# EAGLE board nt08 (EAGLE 6.6.0), part 1 of 6
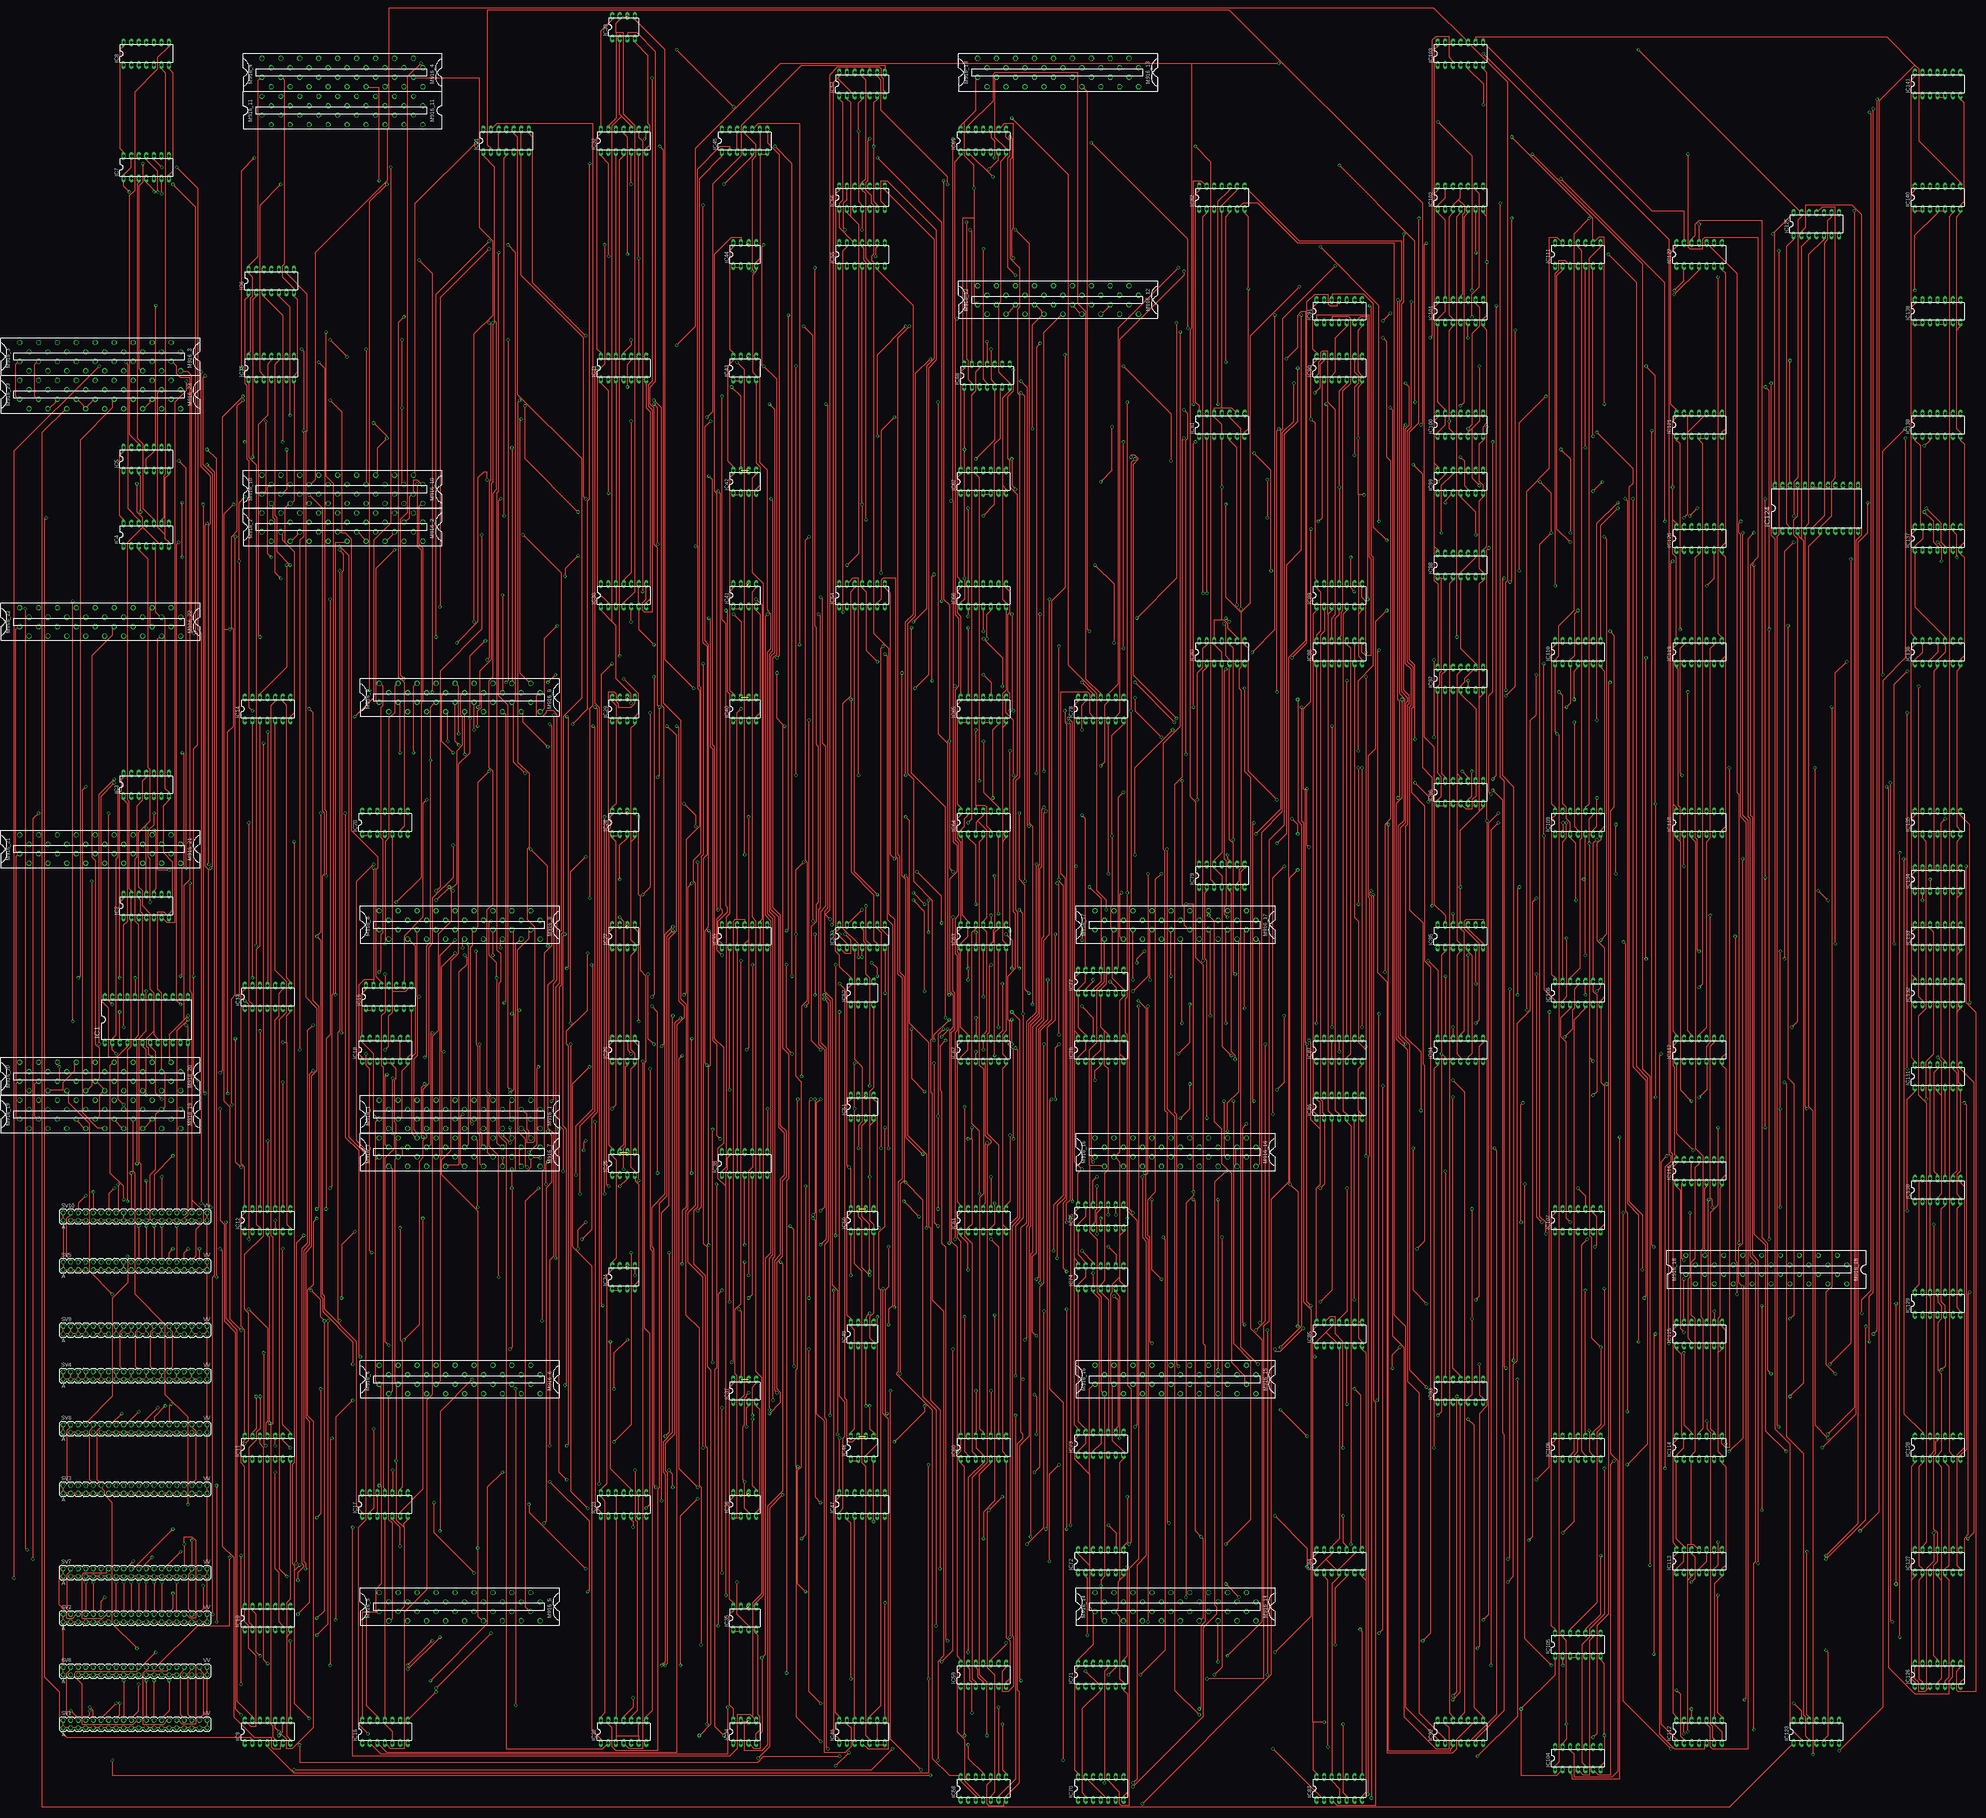
[diagram p7: board, top side]
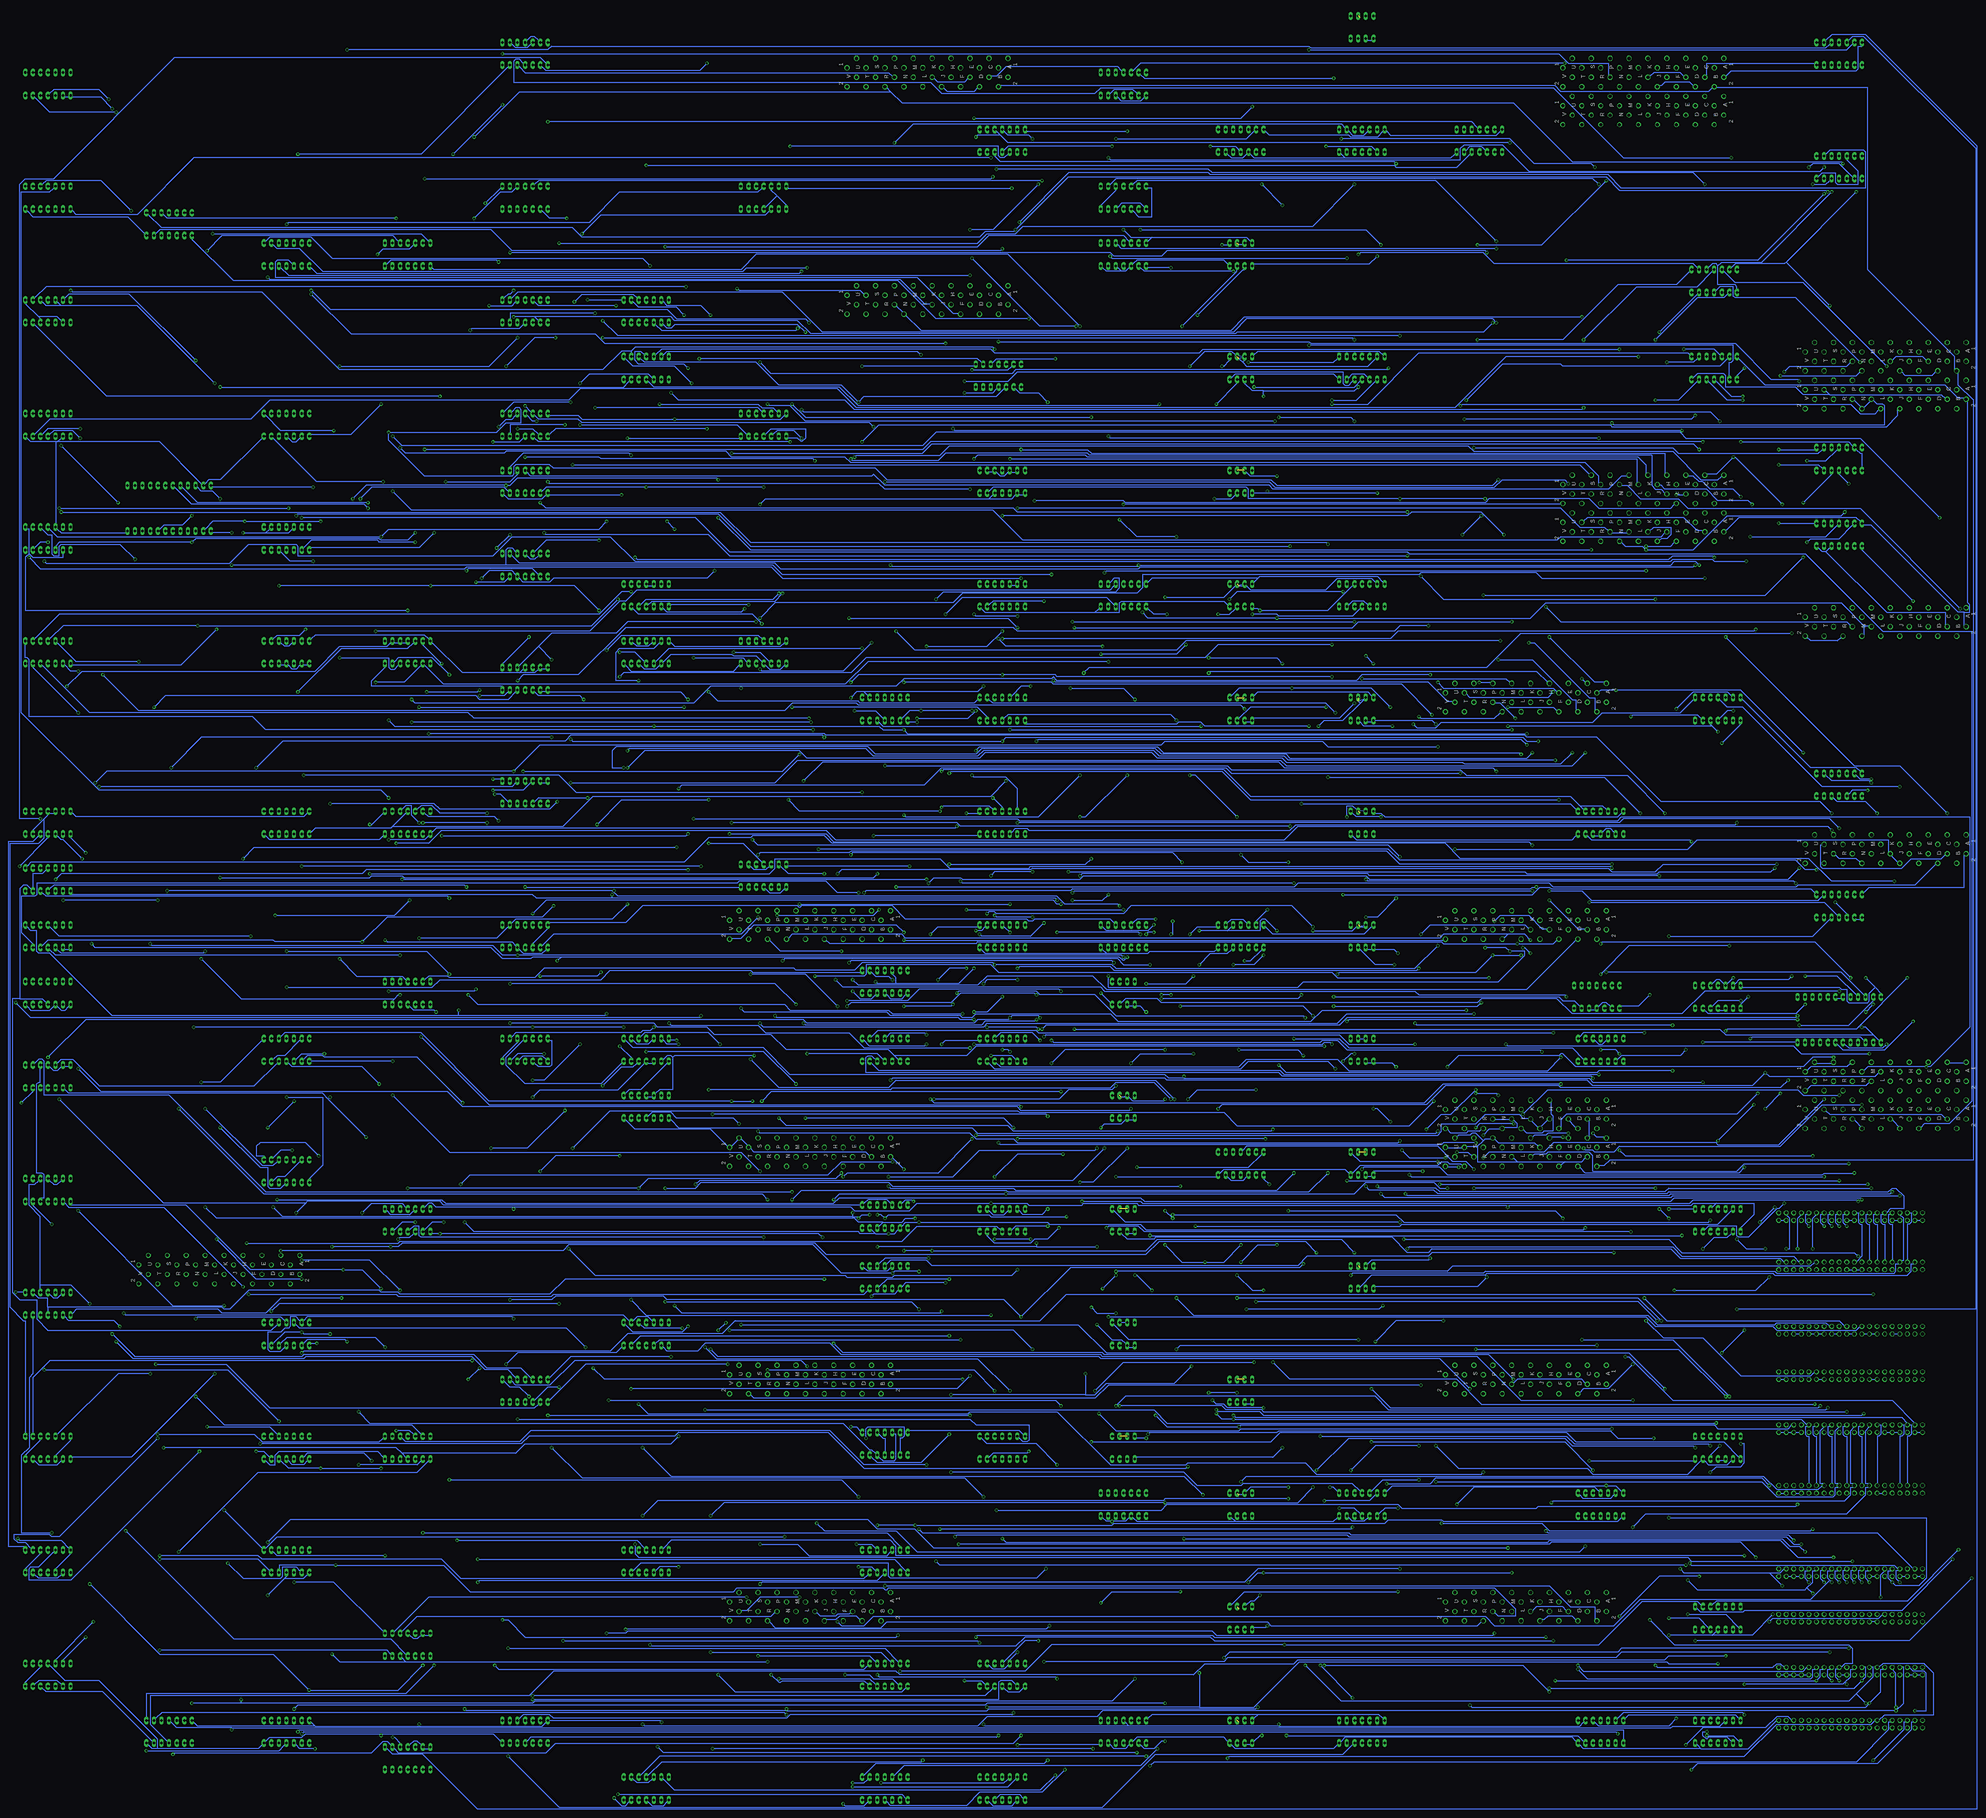
[diagram p8: board, bottom side, seen from below]

No outline drawn. Coordinates in mm, seen from the top.
Copper layers (1*16): Top 0.035mm / dielectric 1.5mm / Bottom 0.035mm
Design rules "10mils": minimum track width 10mil, minimum drill 24mil, track to track 10mil, track to pad 10mil, pad to pad 10mil, via to via 10mil, smd to smd 10mil, copper to edge 40mil, drill to drill 10mil, minimum pad ring 10mil, minimum via ring 8mil, stop-mask expansion 0mil, vias tented up to drill 0mil, thermal gap 10mil

## Footprints (pad centres in the part's own frame; a part is rotated, then mirrored left to right if it is on the bottom)
DIL24-6 = drill 0.813 long: 1 -13.97,-7.62; 2 -11.43,-7.62; 3 -8.89,-7.62; 4 -6.35,-7.62; 5 -3.81,-7.62; 6 -1.27,-7.62; 7 1.27,-7.62; 8 3.81,-7.62; 9 6.35,-7.62; 10 8.89,-7.62; 11 11.43,-7.62; 12 13.97,-7.62; 13 13.97,7.62; 14 11.43,7.62; 15 8.89,7.62; 16 6.35,7.62; 17 3.81,7.62; 18 1.27,7.62; 19 -1.27,7.62; 20 -3.81,7.62; 21 -6.35,7.62; 22 -8.89,7.62; 23 -11.43,7.62; 24 -13.97,7.62
DIL14 = drill 0.813 long: 1 -7.62,-3.81; 2 -5.08,-3.81; 3 -2.54,-3.81; 4 0,-3.81; 5 2.54,-3.81; 6 5.08,-3.81; 7 7.62,-3.81; 8 7.62,3.81; 9 5.08,3.81; 10 2.54,3.81; 11 0,3.81; 12 -2.54,3.81; 13 -5.08,3.81; 14 -7.62,3.81
DIL08 = drill 0.813 long: 1 -3.81,-3.81; 2 -1.27,-3.81; 3 1.27,-3.81; 4 3.81,-3.81; 5 3.81,3.81; 6 1.27,3.81; 7 -1.27,3.81; 8 -3.81,3.81
H807 = drill 1.092 octagon: A1 4.763,28.575; A2 -1.587,28.575; B1 1.587,25.4; B2 -4.763,25.4; C1 4.763,22.225; C2 -1.587,22.225; D1 1.587,19.05; D2 -4.763,19.05; E1 4.763,15.875; E2 -1.587,15.875; F1 1.587,12.7; F2 -4.763,12.7; H1 4.763,9.525; H2 -1.587,9.525; J1 1.587,6.35; J2 -4.763,6.35; K1 4.763,3.175; K2 -1.587,3.175; L1 1.587,0; L2 -4.763,0; M1 4.763,-3.175; M2 -1.587,-3.175; N1 1.587,-6.35; N2 -4.763,-6.35; P1 4.763,-9.525; P2 -1.587,-9.525; R1 1.587,-12.7; R2 -4.763,-12.7; S1 4.763,-15.875; S2 -1.587,-15.875; T1 1.587,-19.05; T2 -4.763,-19.05; U1 4.763,-22.225; U2 -1.587,-22.225; V1 1.587,-25.4; V2 -4.763,-25.4
H807@1 = drill 1.016 octagon: A1 4.763,28.575; A2 -1.587,28.575; B1 1.587,25.4; B2 -4.763,25.4; C1 4.763,22.225; C2 -1.587,22.225; D1 1.587,19.05; D2 -4.763,19.05; E1 4.763,15.875; E2 -1.587,15.875; F1 1.587,12.7; F2 -4.763,12.7; H1 4.763,9.525; H2 -1.587,9.525; J1 1.587,6.35; J2 -4.763,6.35; K1 4.763,3.175; K2 -1.587,3.175; L1 1.587,0; L2 -4.763,0; M1 4.763,-3.175; M2 -1.587,-3.175; N1 1.587,-6.35; N2 -4.763,-6.35; P1 4.763,-9.525; P2 -1.587,-9.525; R1 1.587,-12.7; R2 -4.763,-12.7; S1 4.763,-15.875; S2 -1.587,-15.875; T1 1.587,-19.05; T2 -4.763,-19.05; U1 4.763,-22.225; U2 -1.587,-22.225; V1 1.587,-25.4; V2 -4.763,-25.4
DEC40PINV = drill 1.016 octagon: A -24.13,-1.27; AA 3.81,-1.27; B -24.13,1.27; BB 3.81,1.27; C -21.59,-1.27; CC 6.35,-1.27; D -21.59,1.27; DD 6.35,1.27; E -19.05,-1.27; EE 8.89,-1.27; F -19.05,1.27; FF 8.89,1.27; H -16.51,-1.27; HH 11.43,-1.27; J -16.51,1.27; JJ 11.43,1.27; K -13.97,-1.27; KK 13.97,-1.27; L -13.97,1.27; LL 13.97,1.27; M -11.43,-1.27; MM 16.51,-1.27; N -11.43,1.27; NN 16.51,1.27; P -8.89,-1.27; PP 19.05,-1.27; R -8.89,1.27; RR 19.05,1.27; S -6.35,-1.27; SS 21.59,-1.27; T -6.35,1.27; TT 21.59,1.27; U -3.81,-1.27; UU 24.13,-1.27; V -3.81,1.27; VV 24.13,1.27; W -1.27,-1.27; X -1.27,1.27; Y 1.27,-1.27; Z 1.27,1.27

## Placement (x,y rotation side)
IC1  74154N  [DIL24-6]  0,257.81 0 top
IC2  74LS10N  [DIL14]  0,295.91 0 top
IC3  74LS04N  [DIL14]  0,336.55 0 top
IC4  74LS04N  [DIL14]  0,420.37 0 top
IC5  74LS74N  [DIL14]  0,445.77 0 top
IC6  74LS74N  [DIL14]  41.91,505.46 0 top
IC7  74LS74N  [DIL14]  0,543.56 0 top
IC8  74LS20N  [DIL14]  0,581.66 0 top
IC9  74LS20N  [DIL14]  40.64,19.05 0 top
IC10  74LS20N  [DIL14]  40.64,57.15 0 top
IC11  74LS00N  [DIL14]  40.64,114.3 0 top
IC12  74LS00N  [DIL14]  40.64,190.5 0 top
IC13  74LS00N  [DIL14]  40.64,265.43 0 top
IC14  74LS04N  [DIL14]  40.64,361.95 0 top
IC15  74LS04N  [DIL14]  41.91,476.25 0 top
IC16  74LS00N  [DIL14]  80.01,19.05 0 top
IC17  74LS00N  [DIL14]  80.01,95.25 0 top
IC18  74H40N  [DIL14]  80.01,247.65 0 top
IC19  74H40N  [DIL14]  81.28,265.43 0 top
IC20  74H40N  [DIL14]  80.01,323.85 0 top
IC21  74LS02N  [DIL14]  120.65,552.45 0 top
IC22  74LS02N  [DIL14]  160.02,19.05 0 top
IC23  74LS02N  [DIL14]  160.02,95.25 0 top
IC24  DS75452N  [DIL08]  160.02,171.45 0 top
IC25  DS75452N  [DIL08]  160.02,209.55 0 top
IC26  DS75452N  [DIL08]  160.02,247.65 0 top
IC27  DS75452N  [DIL08]  160.02,285.75 0 top
IC28  DS75452N  [DIL08]  160.02,323.85 0 top
IC29  DS75452N  [DIL08]  160.02,361.95 0 top
IC30  74LS02N  [DIL14]  160.02,400.05 0 top
IC31  74LS02N  [DIL14]  160.02,476.25 0 top
IC32  74LS02N  [DIL14]  160.02,552.45 0 top
IC33  DS75452N  [DIL08]  160.02,590.55 0 top
IC34  DS75452N  [DIL08]  200.66,19.05 0 top
IC35  DS75452N  [DIL08]  200.66,57.15 0 top
IC36  DS75452N  [DIL08]  200.66,95.25 0 top
IC37  DS75452N  [DIL08]  200.66,133.35 0 top
IC38  74LS02N  [DIL14]  200.66,209.55 0 top
IC39  74LS02N  [DIL14]  200.66,285.75 0 top
IC40  DS75452N  [DIL08]  200.66,361.95 0 top
IC41  DS75452N  [DIL08]  200.66,400.05 0 top
IC42  DS75452N  [DIL08]  200.66,438.15 0 top
IC43  DS75452N  [DIL08]  200.66,476.25 0 top
IC44  DS75452N  [DIL08]  200.66,514.35 0 top
IC45  74LS02N  [DIL14]  200.66,552.45 0 top
IC46  74LS02N  [DIL14]  240.03,19.05 0 top
IC47  74LS02N  [DIL14]  240.03,95.25 0 top
IC48  DS75452N  [DIL08]  240.03,114.3 0 top
IC49  DS75452N  [DIL08]  240.03,152.4 0 top
IC50  DS75452N  [DIL08]  240.03,190.5 0 top
IC51  DS75452N  [DIL08]  240.03,228.6 0 top
IC52  DS75452N  [DIL08]  240.03,266.7 0 top
IC53  74LS04N  [DIL14]  240.03,285.75 0 top
IC54  74LS04N  [DIL14]  240.03,400.05 0 top
IC55  74LS04N  [DIL14]  240.03,514.35 0 top
IC56  74LS73N  [DIL14]  240.03,533.4 0 top
IC57  74LS73N  [DIL14]  240.03,571.5 0 top
IC58  74LS73N  [DIL14]  280.67,0 0 top
IC59  74LS00N  [DIL14]  280.67,38.1 0 top
IC60  74LS00N  [DIL14]  280.67,114.3 0 top
IC61  74LS00N  [DIL14]  280.67,190.5 0 top
IC62  74LS74N  [DIL14]  280.67,247.65 0 top
IC63  74LS74N  [DIL14]  280.67,285.75 0 top
IC64  74LS74N  [DIL14]  280.67,323.85 0 top
IC65  74H40N  [DIL14]  280.67,361.95 0 top
IC66  74H40N  [DIL14]  280.67,400.05 0 top
IC67  74H40N  [DIL14]  280.67,438.15 0 top
IC68  74LS10N  [DIL14]  281.94,473.71 0 top
IC69  74LS10N  [DIL14]  280.67,552.45 0 top
IC70  74LS20N  [DIL14]  320.04,0 0 top
IC71  74LS20N  [DIL14]  320.04,38.1 0 top
IC72  74LS20N  [DIL14]  320.04,76.2 0 top
IC73  74LS74N  [DIL14]  320.04,115.57 0 top
IC74  74LS74N  [DIL14]  320.04,171.45 0 top
IC75  74LS74N  [DIL14]  320.04,191.77 0 top
IC76  74LS74N  [DIL14]  320.04,247.65 0 top
IC77  74LS74N  [DIL14]  320.04,270.51 0 top
IC78  74LS00N  [DIL14]  320.04,361.95 0 top
IC79  74LS00N  [DIL14]  360.68,306.07 0 top
IC80  74LS00N  [DIL14]  360.68,381 0 top
IC81  74LS00N  [DIL14]  360.68,457.2 0 top
IC82  74LS00N  [DIL14]  360.68,533.4 0 top
IC83  74LS00N  [DIL14]  400.05,0 0 top
IC84  74LS00N  [DIL14]  400.05,76.2 0 top
IC85  74LS00N  [DIL14]  400.05,152.4 0 top
IC86  74LS30N  [DIL14]  400.05,228.6 0 top
IC87  74LS00N  [DIL14]  400.05,247.65 0 top
IC88  74LS00N  [DIL14]  400.05,381 0 top
IC89  74LS30N  [DIL14]  400.05,400.05 0 top
IC90  74LS00N  [DIL14]  400.05,476.25 0 top
IC91  74LS04N  [DIL14]  400.05,495.3 0 top
IC92  74LS04N  [DIL14]  440.69,19.05 0 top
IC93  74LS04N  [DIL14]  440.69,133.35 0 top
IC94  74LS73N  [DIL14]  440.69,247.65 0 top
IC95  74LS73N  [DIL14]  440.69,285.75 0 top
IC96  74LS51N  [DIL14]  440.69,334.01 0 top
IC97  74LS51N  [DIL14]  440.69,372.11 0 top
IC98  74LS51N  [DIL14]  440.69,410.21 0 top
IC99  74LS04N  [DIL14]  440.69,438.15 0 top
IC100  74LS74N  [DIL14]  440.69,457.2 0 top
IC101  74LS74N  [DIL14]  440.69,495.3 0 top
IC102  74LS74N  [DIL14]  440.69,533.4 0 top
IC103  74LS51N  [DIL14]  440.69,581.66 0 top
IC104  74LS51N  [DIL14]  480.06,10.16 0 top
IC105  74LS51N  [DIL14]  480.06,48.26 0 top
IC106  74LS00N  [DIL14]  480.06,114.3 0 top
IC107  74LS00N  [DIL14]  480.06,190.5 0 top
IC108  74LS10N  [DIL14]  480.06,266.7 0 top
IC109  74LS10N  [DIL14]  480.06,323.85 0 top
IC110  74LS10N  [DIL14]  480.06,381 0 top
IC111  74LS04N  [DIL14]  480.06,514.35 0 top
IC112  74LS04N  [DIL14]  520.7,19.05 0 top
IC113  74LS74N  [DIL14]  520.7,76.2 0 top
IC114  74LS74N  [DIL14]  520.7,114.3 0 top
IC115  74LS74N  [DIL14]  520.7,152.4 0 top
IC116  74LS00N  [DIL14]  520.7,207.01 0 top
IC117  74LS00N  [DIL14]  520.7,247.65 0 top
IC118  74LS00N  [DIL14]  520.7,323.85 0 top
IC119  74H40N  [DIL14]  520.7,381 0 top
IC120  74H40N  [DIL14]  520.7,419.1 0 top
IC121  74H40N  [DIL14]  520.7,457.2 0 top
IC122  74LS04N  [DIL14]  520.7,514.35 0 top
IC123  74LS04N  [DIL14]  560.07,19.05 0 top
IC124  74154N  [DIL24-6]  560.07,429.26 0 top
IC125  74LS04N  [DIL14]  560.07,524.51 0 top
IC126  74LS73N  [DIL14]  600.71,38.1 0 top
IC127  74LS73N  [DIL14]  600.71,76.2 0 top
IC128  74LS73N  [DIL14]  600.71,114.3 0 top
IC129  74LS51N  [DIL14]  600.71,162.56 0 top
IC130  74LS51N  [DIL14]  600.71,200.66 0 top
IC131  74LS51N  [DIL14]  600.71,238.76 0 top
IC132  74LS04N  [DIL14]  600.71,266.7 0 top
IC133  74LS30N  [DIL14]  600.71,285.75 0 top
IC134  74LS30N  [DIL14]  600.71,304.8 0 top
IC135  74LS30N  [DIL14]  600.71,323.85 0 top
IC136  74LS74N  [DIL14]  600.71,381 0 top
IC137  74LS74N  [DIL14]  600.71,419.1 0 top
IC138  74LS74N  [DIL14]  600.71,457.2 0 top
IC139  74H40N  [DIL14]  600.71,495.3 0 top
IC140  74H40N  [DIL14]  600.71,533.4 0 top
IC141  74H40N  [DIL14]  600.71,571.5 0 top
M916_1  M302  [H807]  106.68,226.06 90 top
M916_2  M602  [H807]  67.31,422.91 90 top
M916_3  G888  [H807]  -13.97,480.06 90 top
M916_4  M302  [H807]  67.31,575.31 90 top
M916_5  G888  [H807]  106.68,60.96 90 top
M916_6  G888  [H807]  106.68,137.16 90 top
M916_7  M633  [H807]  106.68,213.36 90 top
M916_8  W023  [H807]  106.68,289.56 90 top
M916_9  M916  [H807]  106.68,365.76 90 top
M916_10  M916  [H807]  67.31,435.61 90 top
M916_11  W032  [H807@1]  67.31,562.61 90 top
M916_12  M602  [H807]  307.34,499.11 90 top
M916_13  G888  [H807]  307.34,575.31 90 top
M916_14  G888  [H807]  346.71,60.96 90 top
M916_15  G879  [H807]  346.71,137.16 90 top
M916_16  M633  [H807]  346.71,213.36 90 top
M916_17  W005  [H807]  346.71,289.56 90 top
M916_18  M228  [H807@1]  544.83,173.99 90 top
M916_19  M602  [H807]  -13.97,226.06 90 top
M916_20  M307  [H807]  -13.97,238.76 90 top
M916_21  M401  [H807]  -13.97,314.96 90 top
M916_22  M302  [H807]  -13.97,391.16 90 top
M916_23  M602  [H807]  -13.97,467.36 90 top
SV1  [DEC40PINV]  -3.81,21.59 0 top
SV2  [DEC40PINV]  -3.81,57.15 0 top
SV3  [DEC40PINV]  -3.81,100.33 0 top
SV4  [DEC40PINV]  -3.81,138.43 0 top
SV5  [DEC40PINV]  -3.81,175.26 0 top
SV6  [DEC40PINV]  -3.81,39.37 0 top
SV7  [DEC40PINV]  -3.81,72.39 0 top
SV8  [DEC40PINV]  -3.81,120.65 0 top
SV9  [DEC40PINV]  -3.81,153.67 0 top
SV10  [DEC40PINV]  -3.81,191.77 0 top

## Tracks (layer width: path | path; a pad name or v marks a point on that pad's centre or on a via)
0_TO_EF
  Top 0.254: IC12.3 38.1,187.96 36.83,189.23 36.83,281.31 38.1,282.57 38.1,356.87 IC14.3
0_TO_STA  (via drill 0.61)
  Top 0.254: v54.61,361.95 55.88,360.68 55.88,264.16 57.78,262.25 57.78,194.94 v57.15,194.31
  Bottom 0.254: v54.61,361.95 48.9,367.67 37.47,367.67 36.2,366.39 IC14.13 | v57.15,194.31 48.9,194.31 IC12.8
1_TO_DF  (via drill 0.61)
  Top 0.254: v482.6,266.06 482.6,269.24 IC108.10 | v552.45,417.83 549.27,414.65 v549.27,278.13 | v45.72,451.49 45.72,494.03 39.37,500.38 IC6.3 | v474.35,448.94 477.52,445.77 v477.52,421
  Bottom 0.254: 484.5,264.8 483.24,266.06 v482.6,266.06 | 484.5,264.8 485.14,264.16 IC108.6 | v549.27,278.13 535.94,264.8 484.5,264.8 | IC137.3 598.17,416.56 596.9,417.83 v552.45,417.83 551.18,419.1 489.58,419.1 488.95,418.46 480.06,418.46 v477.52,421 | v45.72,451.49 304.8,451.49 307.34,448.94 v474.35,448.94
1_TO_DTF  (via drill 0.61)
  Top 0.254: v563.25,78.11 574.04,88.9 574.04,417.83 577.22,421 v577.22,431.17 | v596.26,450.21 598.17,452.12 IC138.3
  Bottom 0.254: v563.25,78.11 530.23,78.11 528.96,76.83 468.63,76.83 462.28,70.48 327.02,70.48 325.75,71.75 IC72.6 | v577.22,431.17 v596.26,450.21
76  (via drill 0.61)
  Top 0.254: v438.15,231.78 438.15,140.97 440.69,138.43 IC93.11 | IC87.12 397.51,250.19 397.51,245.11 IC87.3
  Bottom 0.254: v438.15,231.78 435.61,234.31 409.57,234.31 400.69,243.21 IC87.4 399.42,243.21 398.14,243.21 IC87.3 | IC87.9 404.5,250.82 403.23,249.56 399.42,249.56 398.14,250.82 IC87.12
76+77  (via drill 0.61)
  Top 0.254: 395.61,76.83 397.51,78.74 IC84.12 397.51,81.28 400.05,83.82 400.05,147.32 IC85.4 399.42,149.22 395.61,153.03 | 395.61,76.83 392.43,73.66 IC84.1 | 395.61,76.83 399.42,73.03 IC84.4 | IC84.9 405.13,78.74 400.05,73.66 IC84.4 | IC83.4 400.05,-2.54 400.05,0 397.51,2.54 IC83.12 397.51,5.08 397.51,68.58 400.05,71.12 IC84.4 | 395.61,153.03 397.51,154.94 IC85.12 | 395.61,153.03 392.43,149.86 IC85.1 | v577.85,561.98 578.49,561.34 578.49,167 575.31,163.83 v575.31,159.38
  Bottom 0.254: IC83.1 393.06,-4.45 394.33,-5.71 398.14,-5.71 399.42,-4.45 IC83.4 | IC83.9 404.5,3.17 403.23,1.91 399.42,1.91 398.14,3.17 IC83.12 | IC85.12 398.14,156.84 399.42,158.12 403.23,158.12 404.5,156.84 IC85.9 405.76,156.84 407.67,158.75 574.67,158.75 v575.31,159.38 | v577.85,561.98 600.08,561.98 605.15,567.05 IC141.6
76_
  Bottom 0.254: IC87.1 393.06,243.21 401.95,234.31 405.76,234.31 407.04,233.04 IC86.8
77  (via drill 0.61)
  Top 0.254: IC90.1 392.43,473.71 393.06,474.35 393.06,478.15 393.7,478.79 393.7,481.33 394.33,481.96 396.24,481.96 396.24,464.82 398.78,462.28 398.78,393.7 397.51,392.43 397.51,386.08 IC88.12 | v435.61,207.01 435.61,138.43 IC93.13 | v408.94,212.09 408.94,247.65 406.4,250.19 406.4,290.83 405.13,292.1 405.13,375.92 IC88.6 405.13,378.46 405.13,383.54 IC88.9
  Bottom 0.254: IC88.12 398.14,384.18 399.42,382.9 403.23,382.9 404.5,384.18 IC88.9 | v435.61,207.01 430.53,212.09 v408.94,212.09
77_  (via drill 0.61)
  Top 0.254: v408.94,381 408.94,398.14 407.67,399.42 407.67,402.59 IC89.8
  Bottom 0.254: v408.94,381 403.86,381 400.69,377.82 IC88.4
!00  (via drill 0.61)
  Top 0.254: v-7.62,255.27 -7.62,289.56 -6.35,290.83 -6.35,330.2 -7.62,331.47 IC3.1 | v361.31,230.5 361.31,212.72 361.95,212.09 M916_16.S2 | v260.99,233.68 256.54,238.12 v256.54,254.63
  Bottom 0.254: -11.43,252.73 -8.89,255.27 v-7.62,255.27 | -11.43,252.73 -13.34,250.82 IC1.1 | v361.31,230.5 358.14,233.68 v260.99,233.68 | v256.54,254.63 40.01,254.63 38.1,252.73 -11.43,252.73
!0_TO_AC  (via drill 0.61)
  Top 0.254: v203.2,508.63 203.2,546.1 204.47,547.37 204.47,551.18 200.66,554.99 IC45.11
  Bottom 0.254: v203.2,508.63 233.04,508.63 234.31,509.9 IC55.2
!0_TO_DTB  (via drill 0.61)
  Top 0.254: IC102.13 435.61,535.94 435.61,533.4 433.07,530.86 IC102.1 433.07,528.32 435.61,525.78 435.61,500.38 IC101.13 435.61,497.84 435.61,495.3 433.07,492.76 IC101.1 433.07,490.22 433.07,464.82 435.61,462.28 IC100.13 435.61,459.74 435.61,457.2 433.07,454.66 IC100.1 | IC62.1 273.05,245.11 275.59,247.65 275.59,250.19 IC62.13 275.59,252.73 273.05,255.27 273.05,280.67 IC63.1 273.05,283.21 275.59,285.75 275.59,288.29 IC63.13 275.59,290.83 273.69,292.74 273.69,319.4 IC64.1 273.05,321.31 274.32,322.58 274.32,325.12 275.59,326.39 IC64.13 | v290.83,339.73 290.83,358.14 288.29,360.68 288.29,364.49 IC65.8 | v379.73,455.93 379.1,455.3 v379.1,367.67
  Bottom 0.254: v290.83,339.73 290.19,339.09 279.4,339.09 275.59,335.28 275.59,328.93 IC64.13 | v379.73,455.93 430.53,455.93 432.44,454.02 IC100.1 | v379.1,367.67 375.92,364.49 328.93,364.49 328.3,363.86 290.19,363.86 288.93,365.12 IC65.8
!0_TO_EF  (via drill 0.61)
  Top 0.254: v35.56,361.31 34.29,362.58 34.29,445.13 33.66,445.77 33.66,451.49 | 33.66,451.49 33.66,470.54 33.02,471.17 33.02,499.11 34.29,500.38 IC6.1 | v2.54,535.3 2.54,535.94 0,538.48 IC7.4 | 33.66,451.49 v33.02,451.49
  Bottom 0.254: IC5.1 -7.62,443.23 -7.62,447.68 -6.99,447.68 -5.71,448.94 IC5.13 -4.45,450.21 -3.17,451.49 v33.02,451.49 | v35.56,361.31 37.47,361.31 40.01,358.77 IC14.4 | 40.64,510.54 41.27,511.18 42.55,511.18 43.81,509.9 IC6.10 | 40.64,510.54 40.64,504.19 34.92,504.19 34.29,503.56 34.29,502.92 IC6.1 | v2.54,535.3 26.04,511.81 39.37,511.81 40.64,510.54
!0_TO_LPB
  Top 0.254: IC126.2 595.63,35.56 594.36,36.83 594.36,69.85 595.63,71.12 IC127.2 595.63,73.66 594.36,74.93 594.36,107.95 595.63,109.22 IC128.2 | IC140.6 605.79,528.32 604.52,527.05 604.52,113.03 605.79,111.76 IC128.6
  Bottom 0.254: IC126.2 596.26,34.92 597.53,36.2 603.88,36.2 605.15,34.92 IC126.6 | IC127.2 596.26,71.75 597.53,70.48 603.88,70.48 605.15,71.75 IC127.6 | IC128.2 596.26,109.86 597.53,108.58 603.88,108.58 605.15,109.86 IC128.6
!0_TO_STA  (via drill 0.61)
  Top 0.254: IC56.6 245.11,530.86 243.84,532.13 v243.84,550.54 243.84,565.15 245.11,566.42 IC57.6 | v46.99,410.21 46.99,375.92 38.1,367.03 IC14.12 | v234.95,410.21 238.76,414.02 238.76,524.51 236.22,527.05 | 236.22,527.05 234.95,528.32 IC56.2 | 236.22,527.05 236.22,565.15 234.95,566.42 IC57.2 | v434.34,246.38 435.61,245.11 IC94.2 | v434.34,246.38 434.34,279.4 435.61,280.67 IC95.2 | v291.46,125.09 291.46,3.17 285.75,-2.54 IC58.6 | v433.07,125.09 434.34,126.36 v434.34,246.38 | v318.13,410.21 324.49,403.86 v324.49,384.18 | v361.95,375.29 361.31,374.65 361.31,311.79 361.95,311.15 361.95,295.91 361.31,295.27 361.31,293.37 v362.58,292.1
  Bottom 0.254: IC57.2 235.59,568.33 236.85,569.6 243.21,569.6 244.47,568.33 IC57.6 | v243.84,550.54 278.76,550.54 280.04,549.27 IC69.4 | v46.99,410.21 48.26,411.48 55.24,411.48 56.52,410.21 v234.95,410.21 235.59,409.57 317.5,409.57 v318.13,410.21 | IC58.2 276.23,-4.45 277.5,-5.71 283.85,-5.71 285.12,-4.45 IC58.6 | v434.34,246.38 443.23,246.38 445.13,244.47 IC94.6 | v433.07,125.09 v291.46,125.09 | v324.49,384.18 334.01,374.65 361.31,374.65 v361.95,375.29 | v362.58,292.1 368.3,286.38 431.17,286.38 434.98,282.57 IC95.2
!01  (via drill 0.61)
  Top 0.254: v-9.53,334.64 -9.53,312.42 -10.16,311.79 -10.16,252.73 -11.43,251.46 IC1.2 -11.43,248.92 -11.43,247.65 v-10.16,246.38 | v111.76,249.56 111.76,220.34 112.39,219.71 112.39,215.26 M916_7.N1
  Bottom 0.254: v-9.53,334.64 -4.45,334.64 -3.17,333.38 IC3.3 | v111.76,249.56 111.12,248.92 15.24,248.92 12.7,246.38 v-10.16,246.38
!02  (via drill 0.61)
  Top 0.254: v-8.89,260.35 -8.89,251.46 IC1.3 | v-11.43,262.89 -12.7,264.16 v-12.7,327.02 | v31.75,208.28 29.84,210.19 v29.84,251.46
  Bottom 0.254: v-8.89,260.35 v-11.43,262.89 | v-12.7,327.02 -8.89,330.83 0.64,330.83 1.91,332.11 IC3.5 | v31.75,208.28 33.66,206.38 85.09,206.38 87,208.28 M916_7.D2 | v29.84,251.46 29.21,252.09 -6.99,252.09 -8.26,250.82 IC1.3
!03  (via drill 0.61)
  Top 0.254: -9.53,245.75 -10.16,245.11 -12.7,245.11 -12.7,261.62 -15.24,264.16 -15.24,332.74 v-10.79,337.19 | -9.53,245.75 -6.35,248.92 IC1.4 | v85.72,214.63 85.72,212.09 90.17,212.09 M916_7.E2 | v-7.62,229.24 -9.53,231.14 -9.53,245.75
  Bottom 0.254: v-10.79,337.19 -10.16,337.82 2.54,337.82 4.45,339.73 IC3.9 | v85.72,214.63 85.09,214 82.55,214 81.92,213.36 75.56,213.36 73.66,215.26 19.68,215.26 5.71,229.24 v-7.62,229.24
!04  (via drill 0.61)
  Top 0.254: IC3.11 0,339.09 -1.27,337.82 -1.27,331.47 -3.17,329.56 -3.17,312.42 -3.81,311.79 -3.81,290.83 -2.54,289.56 -2.54,252.73 -3.81,251.46 IC1.5 -3.17,249.56 v-3.17,209.55
  Bottom 0.254: v-3.17,209.55 31.75,209.55 34.29,207.01 82.55,207.01 82.55,212.09 83.82,213.36 97.79,213.36 98.42,212.72 102.23,212.72 102.87,212.09 M916_7.K2
!05  (via drill 0.61)
  Top 0.254: v-10.79,338.45 -15.88,333.38 v-15.88,249.56 | v106.05,226.06 105.41,225.43 105.41,209.55 106.05,208.91 M916_7.L2 | v0,232.41 0,247.65 -1.27,248.92 IC1.6
  Bottom 0.254: v-10.79,338.45 -6.99,338.45 -5.71,339.73 IC3.13 | v-15.88,249.56 -14.61,248.28 -3.17,248.28 -1.91,249.56 IC1.6 | v106.05,226.06 97.79,234.31 13.97,234.31 12.06,232.41 v0,232.41
!06  (via drill 0.61)
  Top 0.254: v-24.77,257.18 v-24.77,398.14 | v119.38,211.46 119.38,208.91 M916_7.R2 | v5.08,231.14 3.17,233.04 3.17,247.01 1.27,248.92 IC1.7
  Bottom 0.254: v-24.77,398.14 -7.62,415.29 IC4.1 | v-24.77,257.18 -15.24,247.65 -1.27,247.65 0.64,249.56 IC1.7 | v119.38,211.46 117.47,213.36 99.06,213.36 95.89,216.53 41.27,216.53 40.64,215.9 20.32,215.9 v5.08,231.14
!07  (via drill 0.61)
  Top 0.254: 2.54,254 2.54,252.73 3.81,251.46 IC1.8 | 2.54,254 2.54,266.7 1.27,267.97 1.27,293.37 -1.27,295.91 -1.27,300.99 -2.54,302.26 -2.54,320.68 1.27,324.49 1.27,341.63 0.64,342.26 0.64,412.12 -2.54,415.29 IC4.3 | v128.27,213.36 130.81,215.9 130.81,241.3 v131.44,241.94 | v1.91,245.11 0.64,246.38 0.64,248.28 0,248.92 0,251.46 2.54,254
  Bottom 0.254: v128.27,213.36 124.46,213.36 123.19,212.09 M916_7.S2 | v131.44,241.94 127.64,245.75 93.98,245.75 93.34,246.38 92.71,246.38 88.27,241.94 12.06,241.94 8.89,245.11 v1.91,245.11
!76  (via drill 0.61)
  Top 0.254: v577.85,149.86 577.85,165.1 579.12,166.37 v579.12,563.25
  Bottom 0.254: v577.85,149.86 572.13,144.15 514.99,144.15 514.35,144.78 458.47,144.78 454.02,140.34 446.4,140.34 443.87,137.79 IC93.10 | v579.12,563.25 582.93,567.05 592.46,567.05 IC141.1 593.73,567.05 595,567.05 IC141.2
!77  (via drill 0.61)
  Top 0.254: v579.12,152.4 580.39,153.67 v580.39,566.42 | IC141.5 602.62,567.05 601.35,567.05 IC141.4
  Bottom 0.254: v579.12,152.4 571.5,144.78 515.62,144.78 514.99,145.41 457.83,145.41 453.39,140.97 441.96,140.97 438.79,137.79 IC93.12 | v580.39,566.42 583.57,569.6 598.8,569.6 600.08,568.33 IC141.4
!ADDR_ACC  (via drill 0.61)
  Top 0.254: v534.03,182.88 534.03,333.38 533.4,334.01 533.4,508 523.88,517.52 IC122.10
  Bottom 0.254: v534.03,182.88 483.24,182.88 482.6,183.51 314.32,183.51 309.25,188.59 282.57,188.59 281.31,187.32 IC61.4
!B-BRK  (via drill 0.61)
  Top 0.254: 157.48,17.78 157.48,21.59 IC22.12 157.48,24.13 157.48,90.17 IC23.3 157.48,92.71 157.48,97.79 IC23.12 | 157.48,17.78 157.48,16.51 IC22.3 | 165.1,17.78 165.1,21.59 IC22.9 | 165.1,17.78 165.1,16.51 IC22.6 | 157.48,17.78 165.1,17.78 | IC23.6 165.1,92.71 165.1,97.79 IC23.9 | IC21.3 118.11,549.91 118.11,554.99 IC21.12 | v147.32,432.44 146.69,433.07 146.69,486.41 125.73,507.37 125.73,547.37 IC21.6 125.73,549.91 125.73,554.99 IC21.9 | v140.97,103.5 138.43,106.05 v138.43,220.98 | v121.92,234.31 121.28,234.95 121.28,363.22 118.11,366.39 118.11,431.8 v118.75,432.44
  Bottom 0.254: IC23.3 158.12,90.81 159.38,89.53 163.19,89.53 164.47,90.81 IC23.6 | IC67.6 285.12,434.98 283.85,436.25 198.75,436.25 198.12,435.61 198.12,432.44 v147.32,432.44 v118.75,432.44 | IC21.3 118.75,549.27 120.02,550.54 123.83,550.54 125.09,549.27 IC21.6 | v140.97,103.5 153.03,103.5 156.84,99.69 IC23.12 | v138.43,220.98 133.35,226.06 130.18,226.06 v121.92,234.31
!BAC_00  (via drill 0.61)
  Top 0.254: v234.31,286.38 236.22,284.48 236.22,280.04 234.31,280.04 233.04,281.31 IC53.1 | v262.25,287.02 v262.25,297.81 | v411.48,299.72 411.48,130.18 412.12,129.54 412.12,-5.71 399.42,-5.71 398.14,-4.45 IC83.3
  Bottom 0.254: v234.31,286.38 234.95,287.02 v262.25,287.02 | v262.25,297.81 262.89,298.45 411.48,298.45 | 411.48,298.45 436.88,298.45 438.15,299.72 593.09,299.72 IC134.1 | 411.48,298.45 v411.48,299.72
!BAC_01  (via drill 0.61)
  Top 0.254: v241.3,295.91 241.3,284.48 242.57,283.21 IC53.5 | v560.71,300.99 v563.88,297.81 | v595.63,297.81 595.63,299.72 IC134.2 | v410.85,-3.17 410.85,299.08 410.21,299.72 410.21,300.36 v410.85,300.99
  Bottom 0.254: v241.3,295.91 241.94,296.55 259.71,296.55 262.25,299.08 409.57,299.08 411.48,300.99 | 411.48,300.99 v560.71,300.99 | v563.88,297.81 v595.63,297.81 | v410.85,-3.17 408.31,-5.71 407.04,-5.71 405.76,-4.45 IC83.6 | 411.48,300.99 v410.85,300.99
!BAC_02  (via drill 0.61)
  Top 0.254: v246.38,214.63 246.38,287.02 245.11,288.29 IC53.9 | v386.08,154.94 386.08,200.03 v383.54,202.56 383.54,305.44 v386.08,307.98 | v598.17,304.8 598.17,302.26 IC134.3
  Bottom 0.254: v246.38,214.63 257.18,203.84 382.27,203.84 v383.54,202.56 | v386.08,154.94 387.99,153.03 404.5,153.03 407.04,155.57 IC85.8 | v598.17,304.8 596.26,306.7 495.3,306.7 494.03,307.98 v386.08,307.98
!BAC_03  (via drill 0.61)
  Top 0.254: v240.03,294.64 235.59,290.19 IC53.13 | v292.74,294.64 294,293.37 v294,259.71 294,191.13 291.46,188.59 v291.46,138.43 | v405.13,133.99 407.04,132.08 407.04,80.64 IC84.8 | v460.38,302.26 459.74,301.62 v459.74,266.06
  Bottom 0.254: v292.74,294.64 v240.03,294.64 | v291.46,138.43 295.91,133.99 v405.13,133.99 | v460.38,302.26 461.01,302.89 598.8,302.89 600.08,301.62 IC134.4 | v459.74,266.06 456.56,262.89 353.69,262.89 351.79,260.99 318.77,260.99 317.5,259.71 v294,259.71
!BAC_04  (via drill 0.61)
  Top 0.254: v463.55,83.19 464.82,84.45 464.82,297.18 v466.09,298.45
  Bottom 0.254: v463.55,83.19 403.23,83.19 400.69,80.64 IC84.11 | v466.09,298.45 466.73,299.08 601.35,299.08 602.62,300.36 IC134.5
!BAC_05  (via drill 0.61)
  Top 0.254: v294.64,150.5 295.27,151.13 295.27,188.59 295.91,189.23 295.91,256.54 299.08,259.71 299.08,309.25 299.72,309.88 v299.72,393.7
  Bottom 0.254: v294.64,150.5 395.61,150.5 396.88,149.22 IC85.3 | v299.72,393.7 294,399.42 245.75,399.42 243.21,396.88 IC54.5
!BAC_06  (via drill 0.61)
  Top 0.254: v298.45,151.76 297.18,153.03 297.18,178.44 298.45,179.71 298.45,255.27 300.99,257.81 300.99,284.48 302.89,286.38 v302.89,398.78
  Bottom 0.254: v298.45,151.76 401.95,151.76 404.5,149.22 IC85.6 | v302.89,398.78 300.36,401.32 242.57,401.32 241.3,402.59 241.3,405.76 243.21,405.76 244.47,404.5 IC54.9
!BAC_07  (via drill 0.61)
  Top 0.254: v238.76,339.73 238.76,405.76 236.85,405.76 235.59,404.5 IC54.13 | v254.63,325.75 255.91,324.49 255.91,256.54 262.25,250.19 262.25,188.59 262.89,187.96 262.89,130.18 266.06,127 v266.06,73.66
  Bottom 0.254: v238.76,339.73 252.73,325.75 v254.63,325.75 | v266.06,73.66 269.24,70.48 318.13,70.48 318.77,71.12 318.77,75.56 401.95,75.56 404.5,73.03 IC84.6
!BAC_08  (via drill 0.61)
  Top 0.254: v238.76,214.63 238.76,222.25 240.03,223.52 240.03,241.94 237.49,244.47 237.49,280.67 IC53.3 | v254.63,203.2 260.35,197.49 260.35,131.44 264.8,127 v264.8,54.61 | v407.04,53.34 407.67,52.7 407.67,5.08 IC83.8
  Bottom 0.254: v238.76,214.63 250.19,203.2 v254.63,203.2 | v264.8,54.61 266.06,53.34 v407.04,53.34
!BAC_09  (via drill 0.61)
  Top 0.254: v242.57,235.59 242.57,271.78 241.3,273.05 241.3,283.21 240.66,283.85 240.66,287.65 240.03,288.29 IC53.11 | v303.53,231.14 302.89,230.5 302.89,133.99 307.34,129.54 v307.34,9.53
  Bottom 0.254: v242.57,235.59 243.84,234.31 258.44,234.31 261.62,231.14 v303.53,231.14 | v307.34,9.53 307.98,8.89 394.97,8.89 399.42,4.45 IC83.11
!BAC_10  (via drill 0.61)
  Top 0.254: v48.26,114.3 45.72,116.84 IC11.9 | v175.26,106.68 176.53,105.41 v176.53,100.97 | v378.46,91.44 389.25,80.64 v389.25,74.3 | v225.43,393.7 226.06,393.06 226.06,295.27 225.43,294.64 225.43,249.56 227.33,247.65 227.33,194.94 v226.06,193.68 | v223.52,191.13 224.16,190.5 224.16,97.79 v226.06,95.89
  Bottom 0.254: v48.26,114.3 48.9,114.94 89.53,114.94 92.08,117.47 164.47,117.47 v175.26,106.68 | v176.53,100.97 181.61,95.89 v226.06,95.89 374.01,95.89 v378.46,91.44 | v389.25,74.3 395.61,74.3 396.88,73.03 IC84.3 | v225.43,393.7 229.87,393.7 231.78,395.61 IC54.1 | v226.06,193.68 v223.52,191.13
!BAC_11  (via drill 0.61)
  Top 0.254: v402.59,201.29 402.59,160.02 400.05,157.48 IC85.11 | v480.06,201.29 482.6,198.75 482.6,195.58 IC107.10 | v245.11,299.72 237.49,307.34 237.49,394.97 IC54.3 | v257.18,297.81 260.99,294 v260.99,267.33 | v332.74,264.16 335.28,261.62 335.28,207.01 v334.64,206.38
  Bottom 0.254: v480.06,201.29 v402.59,201.29 399.42,204.47 336.55,204.47 v334.64,206.38 | v245.11,299.72 247.01,297.81 v257.18,297.81 | v260.99,267.33 261.62,267.97 308.61,267.97 312.42,264.16 v332.74,264.16
!BLK_IN_SYNC  (via drill 0.61)
  Top 0.254: v250.82,116.2 260.99,126.36 v260.99,128.27 | v412.75,130.18 413.38,130.81 v413.38,259.71 | v462.92,260.99 462.92,434.98 470.54,442.6 470.54,520.07 473.07,520.07 474.35,518.79 IC111.13
  Bottom 0.254: v250.82,116.2 190.5,116.2 187.32,119.38 91.44,119.38 88.27,116.2 38.73,116.2 33.66,111.12 IC11.1 | v260.99,128.27 262.89,130.18 v412.75,130.18 | v413.38,259.71 414.02,259.08 462.92,259.08 | 462.92,259.08 579.12,259.08 600.08,280.04 603.88,280.04 604.52,280.67 604.52,287.65 606.42,287.65 607.7,288.93 IC133.8 | 462.92,259.08 v462.92,260.99
!BMB_00  (via drill 0.61)
  Top 0.254: v379.1,316.87 382.27,320.04 382.27,410.21 387.35,415.29 v387.35,494.03
  Bottom 0.254: v379.1,316.87 367.67,316.87 361.31,310.51 IC79.11 | v387.35,494.03 389.89,496.57 402.59,496.57 404.5,498.48 IC91.9
!BMB_01  (via drill 0.61)
  Top 0.254: v370.84,381 378.46,388.62 v378.46,494.03
  Bottom 0.254: v370.84,381 361.95,381 358.77,377.82 IC80.3 | v378.46,494.03 381.63,497.2 393.06,497.2 394.33,498.48 IC91.13
!BMB_02
  Top 0.254: IC82.6 366.39,530.23 367.67,531.5 372.75,531.5 386.08,518.16 418.46,518.16 418.46,158.75 422.27,154.94 422.27,27.3 433.07,16.51 IC92.1
!BMB_03  (via drill 0.61)
  Top 0.254: v422.27,457.2 421.64,456.56 421.64,368.3 423.55,366.39 423.55,363.86 422.91,363.22 422.91,323.21 422.27,322.58 422.27,252.09 427.36,247.01 v427.36,227.33 | v452.12,214.63 452.75,214 452.75,24.77 443.87,15.88 IC92.5
  Bottom 0.254: v422.27,457.2 369.57,457.2 366.39,454.02 IC81.6 | v427.36,227.33 440.06,214.63 v452.12,214.63
!BMB_05  (via drill 0.61)
  Top 0.254: v417.19,462.92 417.83,462.28 417.83,151.76 421.64,147.96 421.64,24.13 432.44,13.34 436.88,13.34 436.88,20.32 435.61,21.59 IC92.13
  Bottom 0.254: v417.19,462.92 362.58,462.92 361.31,461.64 IC81.11
!BMB_06  (via drill 0.61)
  Top 0.254: v429.26,134.62 423.55,140.34 423.55,249.56 420.37,252.73 420.37,321.94 422.27,323.85 422.27,363.86 422.91,364.49 422.91,365.76 421,367.67 421,497.84 421.64,498.48 v421.64,521.34
  Bottom 0.254: v429.26,134.62 433.07,134.62 437.51,130.18 IC93.3 | v421.64,521.34 415.29,527.68 360.05,527.68 358.77,528.96 IC82.3
!BMB_07  (via drill 0.61)
  Top 0.254: v347.98,452.75 347.35,452.12 347.35,339.09 344.81,336.55 344.81,226.69 345.44,226.06 345.44,142.24 v346.07,141.6
  Bottom 0.254: v347.98,452.75 350.52,455.3 356.24,455.3 357.5,454.02 IC81.3 | v346.07,141.6 347.98,143.51 424.18,143.51 432.44,135.25 443.87,135.25 445.13,136.53 IC93.9
!BMB_08  (via drill 0.61)
  Top 0.254: v384.18,379.1 389.25,384.18 389.25,498.48 391.8,501.01 396.24,501.01 396.24,497.84 396.88,497.2 399.42,497.2 399.42,498.48 IC91.11
  Bottom 0.254: v384.18,379.1 367.67,379.1 366.39,377.82 IC80.6
!BMB_09  (via drill 0.61)
  Top 0.254: v416.56,323.21 416.56,12.7 437.51,12.7 437.51,13.34 438.15,13.97 IC92.3 | v379.1,331.47 369.57,341 369.57,382.27 368.3,383.54 IC80.8
  Bottom 0.254: v416.56,323.21 408.31,331.47 v379.1,331.47
!BMB_10  (via drill 0.61)
  Top 0.254: v413.38,381.63 412.75,381 412.75,273.69 415.93,270.51 415.93,12.06 438.15,12.06 439.42,13.34 439.42,16.51 445.13,22.23 IC92.9
  Bottom 0.254: v413.38,381.63 408.31,386.71 362.58,386.71 361.31,385.44 IC80.11
!BMB_11  (via drill 0.61)
  Top 0.254: v422.27,249.56 419.74,252.09 419.74,322.58 421.64,324.49 421.64,364.49 422.27,365.12 420.37,367.03 420.37,498.48 421,499.11 421,518.79 386.71,518.79 368.94,536.58 IC82.8 | v438.15,237.49 441.96,233.68 441.96,25.4 440.69,24.13 IC92.11
  Bottom 0.254: v422.27,249.56 434.34,237.49 v438.15,237.49
!BMR00  (via drill 0.61)
  Top 0.254: v306.07,249.56 304.8,248.28 v304.8,231.14 | v93.34,236.22 92.08,234.95 92.08,219.07 v92.71,218.44
  Bottom 0.254: v306.07,249.56 306.7,248.92 325.12,248.92 327.02,250.82 IC76.8 | v304.8,231.14 303.53,229.87 139.06,229.87 132.72,236.22 v93.34,236.22 | v92.71,218.44 96.52,218.44 M916_7.H1
!BMR01  (via drill 0.61)
  Top 0.254: v82.55,219.71 v82.55,238.12
  Bottom 0.254: IC76.5 324.49,245.75 325.75,245.75 326.39,245.11 326.39,240.03 187.96,240.03 186.69,238.76 83.19,238.76 v82.55,238.12 | v82.55,219.71 81.28,218.44 78.74,218.44 M916_7.A1
!C00  (via drill 0.61)
  Top 0.254: v85.09,187.96 85.09,150.5 85.72,149.86 85.72,100.97 85.09,100.33 IC17.9 | v318.77,186.06 318.77,193.04 320.04,194.31 IC75.11 | v309.25,357.5 309.88,356.87 309.88,197.49 308.61,196.22 v308.61,189.87 | v461.64,229.87 461.01,229.24 v461.01,189.87
  Bottom 0.254: v85.09,187.96 85.72,187.32 232.41,187.32 234.31,189.23 264.8,189.23 265.43,189.87 v308.61,189.87 313.06,189.87 314.32,188.59 IC75.2 315.6,187.32 316.87,186.06 v318.77,186.06 323.21,186.06 | 323.21,186.06 324.49,187.32 IC75.6 | v309.25,357.5 311.79,357.5 IC78.1 | v461.64,229.87 476.88,245.11 508,245.11 508.63,245.75 513.72,245.75 514.99,244.47 IC117.2 | v461.01,189.87 457.83,186.69 328.93,186.69 328.3,186.06 323.21,186.06
!C01  (via drill 0.61)
  Top 0.254: v482.6,279.4 482.6,304.8 | 482.6,304.8 482.6,318.77 IC109.5 | v82.55,106.68 82.55,100.33 IC17.10 | v156.84,116.2 162.56,121.92 v162.56,179.71 | v313.69,180.34 317.5,176.53 IC74.12 | v280.67,387.99 280.67,394.97 IC66.4 | v306.07,382.9 v306.07,304.8 306.07,304.17 307.34,302.89 307.34,198.75 304.17,195.58 v304.17,180.34 | 482.6,304.8 v481.96,304.8
  Bottom 0.254: v482.6,279.4 598.17,279.4 600.08,281.31 IC133.4 | v82.55,106.68 92.08,116.2 v156.84,116.2 | v162.56,179.71 167,184.15 228.6,184.15 232.41,180.34 v304.17,180.34 v313.69,180.34 | IC74.8 327.02,174.62 325.75,173.35 319.4,173.35 318.13,174.62 IC74.12 | v280.67,387.99 285.75,382.9 v306.07,382.9 | v481.96,304.8 v306.07,304.8
!CK00  (via drill 0.61)
  Top 0.254: v323.21,270.51 325.12,268.61 325.12,267.97 IC77.6 | v19.68,473.71 19.05,473.07 19.05,443.87 22.23,440.69 22.23,309.25 v21.59,308.61 | v258.44,307.34 266.7,299.08 v266.7,290.19 | v288.29,286.38 290.19,284.48 v290.19,274.95
  Bottom 0.254: 316.23,269.88 316.23,271.78 317.5,273.05 IC77.12 | 316.23,269.88 322.58,269.88 v323.21,270.51 | v19.68,473.71 -5.71,473.71 -6.99,474.98 M916_3.N2 | v21.59,308.61 22.86,307.34 60.33,307.34 60.96,306.7 104.78,306.7 105.41,307.34 v258.44,307.34 | v266.7,290.19 271.14,285.75 287.65,285.75 v288.29,286.38 | v290.19,274.95 295.27,269.88 316.23,269.88
!CK01  (via drill 0.61)
  Top 0.254: v520.7,268.61 521.97,269.88 521.97,450.85 520.7,452.12 IC121.4 521.34,452.75 522.61,452.75 IC121.5
  Bottom 0.254: v520.7,268.61 471.81,268.61 469.26,271.14 415.29,271.14 412.12,274.32 365.12,274.32 364.49,273.69 328.3,273.69 IC77.8 | IC121.2 516.25,452.75 517.52,451.49 518.79,451.49 520.07,452.75 IC121.4
!CLR_DF  (via drill 0.61)
  Top 0.254: v170.18,464.19 171.45,462.92 v171.45,417.19 | v596.26,427.99 599.44,424.81 599.44,417.83 600.71,416.56 IC137.4
  Bottom 0.254: v170.18,464.19 158.12,464.19 140.97,481.33 50.8,481.33 50.16,480.69 IC15.8 | v171.45,417.19 172.09,417.83 365.12,417.83 375.29,427.99 v596.26,427.99
!CLR_DTF  (via drill 0.61)
  Top 0.254: v567.69,12.7 582.29,27.3 582.29,371.48 589.91,379.1 v589.91,452.75
  Bottom 0.254: v567.69,12.7 523.24,12.7 521.34,14.61 IC112.4 | v589.91,452.75 592.46,455.3 598.8,455.3 600.08,454.02 IC138.4
!CSTA  (via drill 0.61)
  Top 0.254: v45.72,236.85 45.72,195.58 IC12.9 | v241.3,425.45 241.3,511.81 240.66,512.45 240.66,516.25 240.03,516.89 IC55.11 | v222.25,419.74 220.98,418.46 220.98,311.15 221.62,310.51 221.62,264.16 219.71,262.25 v219.71,238.76
  Bottom 0.254: v45.72,236.85 82.55,236.85 83.82,238.12 219.71,238.12 | 219.71,238.12 224.79,238.12 226.06,239.4 351.79,239.4 360.68,248.28 404.5,248.28 407.04,250.82 IC87.8 | v241.3,425.45 235.59,419.74 v222.25,419.74 | v219.71,238.76 219.71,238.12
!DATA  (via drill 0.61)
  Top 0.254: v467.36,438.15 471.17,434.34 v471.17,421 467.36,417.19 467.36,191.77 469.26,189.87 v469.26,186.06 | v333.38,38.1 341.63,46.35 341.63,184.15 v341,184.78
  Bottom 0.254: v467.36,438.15 445.77,438.15 443.23,440.69 IC99.10 | v471.17,421 476.25,415.93 512.45,415.93 IC120.1 | v333.38,38.1 325.12,38.1 323.85,36.83 317.5,36.83 315.6,34.92 IC71.2 | v341,184.78 342.26,186.06 v469.26,186.06 471.81,186.06 IC107.1
!DB_00
  Top 0.254: SV10.D -25.4,192.41 -26.67,191.13 -26.67,178.44 -25.4,177.16 SV5.D
  Bottom 0.254: IC24.3 160.66,168.28 156.84,172.09 118.75,172.09 118.11,172.72 22.23,172.72 21.59,172.09 -22.86,172.09 -24.13,173.35 -24.13,175.9 -25.4,175.9 SV5.D
!DB_00_  (via drill 0.61)
  Top 0.254: IC24.1 156.84,167 158.12,167 IC24.2 | v118.11,171.45 118.11,212.09 114.94,215.26 114.94,231.78 115.57,232.41 114.3,233.68 114.3,294.64 116.2,296.55 116.2,341 114.94,342.26 114.94,371.48 116.2,372.75 116.2,434.34 117.47,435.61 117.47,491.49 116.84,492.12 116.84,543.56 113.03,547.37 IC21.1
  Bottom 0.254: v118.11,171.45 121.28,168.28 155.57,168.28 IC24.1
!DB_01  (via drill 0.61)
  Top 0.254: v163.83,172.09 163.83,173.99 IC24.5
  Bottom 0.254: v163.83,172.09 163.19,172.72 119.38,172.72 118.75,173.35 21.59,173.35 20.95,172.72 -18.41,172.72 -19.05,173.35 -19.05,175.9 -20.32,175.9 SV5.J -20.32,177.16 -21.59,177.16 -21.59,191.13 -20.32,192.41 SV10.J
!DB_01_  (via drill 0.61)  (1 unrouted)
  Top 0.254: v120.02,426.72 120.02,546.74 120.65,547.37 IC21.4 | v126.36,420.37 139.06,407.67 139.06,287.65 138.43,287.02 138.43,269.88 137.16,268.61 v137.16,177.8 | 159.38,174.62 160.66,174.62 IC24.7 159.38,174.62
  Bottom 0.254: v126.36,420.37 v120.02,426.72 | v137.16,177.8 137.79,177.16 156.84,177.16 158.12,175.9 IC24.7
!DB_02  (via drill 0.61)
  Top 0.254: v158.75,201.93 161.29,204.47 IC25.3
  Bottom 0.254: v158.75,201.93 157.48,200.66 135.89,200.66 134.62,199.39 57.78,199.39 57.15,200.03 -16.51,200.03 -17.78,201.29 -19.05,201.29 -21.59,198.75 -21.59,194.31 -17.14,194.31 -15.88,193.04 SV10.N -15.24,192.41 -13.97,192.41 -13.97,189.87 -14.61,189.23 -15.24,189.23 -15.24,177.16 SV5.N
!DB_02_  (via drill 0.61)
  Top 0.254: v139.7,207.01 139.7,220.98 138.43,222.25 138.43,268.61 139.06,269.24 139.06,286.38 139.7,287.02 139.7,359.41 146.05,365.76 146.05,445.77 124.46,467.36 124.46,553.72 123.19,554.99 IC21.10
  Bottom 0.254: IC25.2 158.12,205.1 156.84,205.1 IC25.1 156.21,207.01 v139.7,207.01
!DB_03  (via drill 0.61)
  Top 0.254: v134.62,210.19 133.99,209.55 v133.99,202.56 | v-9.53,202.56 -9.53,193.04 SV10.T
  Bottom 0.254: v134.62,210.19 160.66,210.19 163.19,212.72 IC25.5 | v133.99,202.56 v-9.53,202.56 | SV5.T -10.16,177.16 -10.16,189.23 -9.53,189.23 -8.89,189.87 -8.89,192.41 -10.16,192.41 SV10.T
!DB_03_  (via drill 0.61)  (1 unrouted)
  Top 0.254: IC21.13 117.47,558.16 149.86,558.16 149.86,363.22 148.59,361.95 v148.59,298.45 | v158.75,292.1 160.02,290.83 160.02,215.9 158.75,214.63 IC25.7
  Bottom 0.254: v148.59,298.45 154.94,292.1 v158.75,292.1
!DB_04  (via drill 0.61)
  Top 0.254: v160.02,207.65 160.02,214.63 160.66,215.26 160.66,241.94 161.29,242.57 IC26.3 | v-5.08,206.38 -5.08,193.68 SV10.X
  Bottom 0.254: v160.02,207.65 159.38,208.28 133.99,208.28 131.44,205.74 5.71,205.74 5.08,206.38 v-5.08,206.38 | SV5.X -5.71,176.53 -7.62,178.44 -7.62,189.23 -6.99,189.23 -6.35,189.87 -6.35,193.04 -5.71,193.04 SV10.X
!DB_04_  (via drill 0.61)
  Top 0.254: v148.59,241.94 142.88,236.22 142.88,181.61 149.22,175.26 149.22,19.68 152.4,16.51 IC22.1
  Bottom 0.254: v148.59,241.94 149.86,243.21 155.57,243.21 IC26.1 156.84,243.21 158.12,243.21 IC26.2
!DB_05  (via drill 0.61)
  Top 0.254: v165.1,203.84 165.1,248.92 163.83,250.19 IC26.5 | v0,203.84 0,193.68 SV10.BB | v0,188.59 0,177.16 SV5.BB
  Bottom 0.254: v165.1,203.84 v0,203.84 | v0,188.59 1.27,189.87 1.27,192.41 0,192.41 SV10.BB
!DB_05_  (via drill 0.61)
  Top 0.254: IC22.4 161.93,13.34 166.37,13.34 v166.37,243.84 | v162.56,246.38 161.29,247.65 IC26.6
  Bottom 0.254: v166.37,243.84 163.83,246.38 v162.56,246.38 | IC26.6 IC26.7
!DB_06  (via drill 0.61)
  Top 0.254: v149.22,276.23 149.86,275.59 149.86,227.97 144.15,222.25 v144.15,205.74 | v5.08,205.1 5.08,193.68 SV10.FF | v5.08,188.59 5.08,177.16 SV5.FF
  Bottom 0.254: v149.22,276.23 155.57,276.23 160.66,281.31 IC27.3 | v144.15,205.74 143.51,205.1 v5.08,205.1 | v5.08,188.59 6.35,189.87 6.35,192.41 5.08,192.41 SV10.FF
!DB_06_  (via drill 0.61)
  Top 0.254: v163.83,106.68 163.83,90.17 164.47,89.53 164.47,26.04 162.56,24.13 IC22.10 | v140.97,114.94 141.6,115.57 141.6,248.92 140.97,249.56 140.97,254 147.96,260.99 v147.96,280.04
  Bottom 0.254: IC27.2 158.12,281.31 156.84,281.31 IC27.1 155.57,281.31 149.22,281.31 v147.96,280.04 | v163.83,106.68 155.57,114.94 v140.97,114.94
!DB_07  (via drill 0.61)
  Top 0.254: v165.1,257.18 165.1,287.02 163.83,288.29 IC27.5 | v13.97,257.81 10.16,254 10.16,193.68 SV10.LL | v10.16,188.59 10.16,177.16 SV5.LL
  Bottom 0.254: v165.1,257.18 164.47,257.81 v13.97,257.81 | v10.16,188.59 11.43,189.87 11.43,192.41 10.16,192.41 SV10.LL
!DB_07_  (via drill 0.61)  (1 unrouted)
  Top 0.254: v176.53,287.65 174.62,285.75 174.62,198.75 172.09,196.22 172.09,100.97 171.45,100.33 171.45,12.7 157.48,12.7 156.21,13.97 156.21,20.32 154.94,21.59 IC22.13
  Bottom 0.254: v176.53,287.65 163.19,287.65 161.93,288.93 IC27.7 | IC27.7 159.38,288.93 160.66,288.93 IC27.7
!DB_08  (via drill 0.61)
  Top 0.254: v158.75,304.8 158.75,316.23 161.29,318.77 IC28.3 | v14.61,303.53 14.61,267.33 15.24,266.7 15.24,197.49 | 15.24,197.49 15.24,193.68 SV10.RR | 15.24,197.49 19.05,193.68 19.05,189.87 16.51,187.32 16.51,178.44 15.24,177.16 SV5.RR
  Bottom 0.254: v158.75,304.8 158.12,304.17 15.24,304.17 v14.61,303.53
!DB_08_  (via drill 0.61)
  Top 0.254: v150.5,223.52 150.5,94.61 152.4,92.71 IC23.1 | v156.21,227.97 157.48,229.24 157.48,317.5 156.21,318.77 IC28.1 156.84,319.4 158.12,319.4 IC28.2
  Bottom 0.254: v150.5,223.52 154.94,227.97 v156.21,227.97
!DB_09  (via drill 0.61)
  Top 0.254: v153.67,199.39 v153.67,325.75 | v-20.32,198.75 -22.86,196.22 -22.86,193.68 SV10.F
  Bottom 0.254: v153.67,325.75 161.93,325.75 163.19,327.02 IC28.5 | v153.67,199.39 152.4,198.12 56.52,198.12 55.88,198.75 v-20.32,198.75 | SV5.F -22.86,177.16 -22.86,189.23 -23.5,189.23 -24.13,189.87 -24.13,193.04 -23.5,193.04 SV10.F
!DB_09_  (via drill 0.61)  (1 unrouted)
  Top 0.254: v167.64,93.98 168.91,95.25 168.91,152.4 167,154.31 167,243.21 167.64,243.84 167.64,272.42 165.74,274.32 165.74,299.08 165.1,299.72 v165.1,325.75 | 160.66,327.02 159.38,327.02 IC28.7 160.66,327.02
  Bottom 0.254: v167.64,93.98 162.56,93.98 160.66,92.08 IC23.4 | v165.1,325.75 165.1,329.56 163.19,329.56 161.93,328.3 IC28.7
!DB_10  (via drill 0.61)
  Top 0.254: v149.86,356.24 150.5,355.6 150.5,227.33 145.41,222.25 v145.41,199.39 | v-17.78,200.03 -17.78,193.68 SV10.L
  Bottom 0.254: v149.86,356.24 159.38,356.24 160.66,357.5 IC29.3 | v145.41,199.39 144.78,198.75 57.15,198.75 56.52,199.39 -17.14,199.39 v-17.78,200.03 | SV5.L -17.78,177.16 -17.78,189.23 -17.14,189.23 -16.51,189.87 -16.51,192.41 -17.78,192.41 SV10.L
!DB_10_  (via drill 0.61)
  Top 0.254: v155.57,149.86 155.57,107.31 162.56,100.33 IC23.10 | v132.72,156.84 132.72,207.01 133.35,207.65 133.35,280.04 135.89,282.57 135.89,356.24 v135.25,356.87
  Bottom 0.254: IC29.2 158.12,357.5 156.84,357.5 IC29.1 155.57,358.14 136.53,358.14 v135.25,356.87 | v155.57,149.86 148.59,156.84 v132.72,156.84
!DB_11  (via drill 0.61)
  Top 0.254: v154.94,201.93 154.31,202.56 154.31,321.94 154.94,322.58 154.94,367.67 156.84,367.67 157.48,367.03 157.48,364.49 158.12,363.86 158.12,362.58 162.56,362.58 163.83,363.86 163.83,364.49 IC29.5 | v-10.79,201.29 -12.7,199.39 -12.7,193.68 SV10.R
  Bottom 0.254: v154.94,201.93 154.31,201.29 135.25,201.29 133.99,200.03 58.42,200.03 57.15,201.29 v-10.79,201.29 | SV5.R -12.7,177.16 -12.7,189.23 -12.06,189.23 -11.43,189.87 -11.43,192.41 -12.7,192.41 SV10.R
!DB_11_  (via drill 0.61)  (1 unrouted)
  Top 0.254: v172.72,96.52 172.72,193.04 175.26,195.58 175.26,285.12 177.8,287.65 177.8,353.06 v174.62,356.24
  Bottom 0.254: v172.72,96.52 157.48,96.52 155.57,98.42 IC23.13 | v174.62,356.24 172.72,358.14 166.37,358.14 160.66,363.86 | 160.66,363.86 159.38,365.12 IC29.7 161.29,364.49 160.66,363.86
!DF  (via drill 0.61)
  Top 0.254: v228.6,13.34 227.97,13.97 227.97,123.83 227.33,124.46 227.33,182.25 228.6,183.51 228.6,263.52 v227.33,264.8 | v180.34,266.06 180.97,266.7 180.97,318.13 185.42,322.58 185.42,368.3 184.78,368.94 184.78,416.56 | 184.78,416.56 184.78,542.92 192.41,550.54 195.58,550.54 195.58,549.91 IC45.2 | v596.9,429.26 601.98,424.18 601.98,417.83 603.25,416.56 IC137.5 | v520.07,429.26 v517.52,426.72 | v184.15,416.56 184.78,416.56
  Bottom 0.254: v228.6,13.34 234.31,7.62 313.69,7.62 316.87,4.45 IC70.12 | v227.33,264.8 181.61,264.8 v180.34,266.06 | v596.9,429.26 v520.07,429.26 | v517.52,426.72 516.89,427.36 375.92,427.36 365.12,416.56 v184.15,416.56
!DTB_00  (via drill 0.61)
  Top 0.254: v427.36,457.2 427.99,457.83 427.99,531.5 363.22,596.26 114.3,596.26 114.3,551.18 115.57,549.91 IC21.2
  Bottom 0.254: v427.36,457.2 445.77,457.2 445.77,454.66 IC100.6
!DTB_01  (via drill 0.61)
  Top 0.254: v425.45,464.82 425.45,518.79 v400.05,544.2
  Bottom 0.254: v425.45,464.82 444.5,464.82 447.68,461.64 IC100.8 | v400.05,544.2 149.22,544.2 148.59,543.56 128.27,543.56 123.83,548 IC21.5
!DTB_02  (via drill 0.61)
  Top 0.254: v414.65,492.12 v417.19,494.67 | v147.32,487.05 129.54,504.82 129.54,553.72 128.27,554.99 IC21.8
  Bottom 0.254: v417.19,494.67 445.77,494.67 445.77,492.76 IC101.6 | v414.65,492.12 409.57,487.05 v147.32,487.05
!DTB_03  (via drill 0.61)
  Top 0.254: v433.07,558.8 444.5,547.37 v444.5,502.29
  Bottom 0.254: v433.07,558.8 123.19,558.8 121.28,556.89 IC21.11 | v444.5,502.29 445.77,501.01 446.4,501.01 447.68,499.75 IC101.8
!DTB_04  (via drill 0.61)
  Top 0.254: v118.11,514.99 118.11,434.98 117.47,434.34 117.47,281.31 118.75,280.04 118.75,270.51 118.11,269.88 118.11,219.07 120.65,216.53 120.65,13.34 153.03,13.34 154.31,14.61 IC22.2 | v445.77,514.99 445.77,528.32 IC102.6
  Bottom 0.254: v118.11,514.99 118.75,515.62 225.43,515.62 227.33,513.72 243.21,513.72 244.47,514.99 v445.77,514.99
!DTB_05  (via drill 0.61)
  Top 0.254: v446.4,10.79 459.74,24.13 v459.74,137.16 | v455.93,140.97 455.3,141.6 455.3,337.82 454.02,339.09 v454.02,531.5
  Bottom 0.254: v446.4,10.79 429.26,-6.35 247.01,-6.35 229.24,11.43 166.37,11.43 163.19,14.61 IC22.5 | v455.93,140.97 v459.74,137.16 | v454.02,531.5 448.94,536.58 IC102.8
!DTB_06  (via drill 0.61)
  Top 0.254: v168.91,241.3 168.91,180.97 169.54,180.34 169.54,26.04 167.64,24.13 IC22.8
  Bottom 0.254: v168.91,241.3 171.45,243.84 198.12,243.84 200.66,241.3 283.21,241.3 285.12,243.21 IC62.6
!DTB_07  (via drill 0.61)
  Top 0.254: v163.19,30.48 163.19,27.3 160.02,24.13 IC22.11 | v173.99,41.27 174.62,41.91 174.62,106.05 173.99,106.68 173.99,115.57 177.16,118.75 177.16,256.54 v179.07,258.44 | v295.91,266.7 294.64,267.97 294.64,302.89 292.74,304.8 v292.74,327.02
  Bottom 0.254: v173.99,41.27 v163.19,30.48 | v179.07,258.44 179.71,259.08 242.57,259.08 249.56,266.06 267.97,266.06 269.24,267.33 295.27,267.33 v295.91,266.7 | v292.74,327.02 288.93,327.02 IC64.8
!DTB_08  (via drill 0.61)
  Top 0.254: v147.96,93.98 142.24,99.69 v142.24,249.56 | v266.7,252.09 268.61,254 v268.61,254.63 | v285.75,255.27 285.75,280.67 IC63.6
  Bottom 0.254: v147.96,93.98 152.4,93.98 154.31,92.08 IC23.2 | v142.24,249.56 164.47,249.56 167.64,252.73 266.06,252.73 v266.7,252.09 | v268.61,254.63 269.24,255.27 v285.75,255.27
!DTB_09  (via drill 0.61)
  Top 0.254: v163.19,87.63 163.19,89.53 162.56,90.17 IC23.5 | v301.62,87 302.26,87.63 302.26,255.27 304.8,257.81 v304.8,286.38
  Bottom 0.254: v163.19,87.63 163.83,87 v301.62,87 | v304.8,286.38 302.26,288.93 288.93,288.93 IC63.8
!DTB_10  (via drill 0.61)
  Top 0.254: v170.81,100.97 170.18,101.6 170.18,180.97 169.54,181.61 169.54,194.94 173.99,199.39 173.99,286.38 v176.53,288.93 | v285.75,293.37 285.75,318.77 IC64.6
  Bottom 0.254: v170.81,100.97 169.54,100.97 168.28,99.69 IC23.8 | v176.53,288.93 183.51,295.91 237.49,295.91 240.03,293.37 282.57,293.37 283.21,294 285.12,294 v285.75,293.37
!DTB_11  (via drill 0.61)
  Top 0.254: v297.81,106.05 299.72,107.95 299.72,168.28 300.99,169.54 v300.99,249.56
  Bottom 0.254: v297.81,106.05 219.71,106.05 215.26,101.6 200.66,101.6 200.03,102.23 163.19,102.23 160.66,99.69 IC23.11 | v300.99,249.56 299.72,250.82 288.93,250.82 IC62.8
!DTF  (via drill 0.61)
  Top 0.254: v259.71,6.35 249.56,16.51 v249.56,133.35 | v196.22,142.88 196.85,143.51 196.85,290.83 197.49,291.46 198.12,291.46 | 198.12,291.46 200.66,291.46 200.66,290.83 IC39.11 | v589.91,455.93 582.29,448.31 v582.29,373.38 | v199.39,361.95 198.12,360.68 198.12,291.46
  Bottom 0.254: v259.71,6.35 267.33,-1.27 288.29,-1.27 292.74,-5.71 318.13,-5.71 319.4,-4.45 IC70.4 | v249.56,133.35 240.03,142.88 v196.22,142.88 | v589.91,455.93 600.71,455.93 602.62,454.02 IC138.5 | v582.29,373.38 570.23,361.31 353.69,361.31 351.15,363.86 329.56,363.86 328.93,363.22 200.66,363.22 v199.39,361.95
!DTSF
  Top 0.254: IC88.8 407.67,383.54 407.67,381 408.94,379.73 410.85,379.73 410.85,412.12 410.21,412.75 410.21,494.03 392.43,494.03 392.43,492.76 IC91.1
!EA_00  (via drill 0.61)
  Top 0.254: v17.78,180.97 17.78,177.16 SV5.TT
  Bottom 0.254: IC50.3 240.66,186.06 238.76,184.15 229.87,184.15 229.24,184.78 149.86,184.78 144.78,179.71 137.79,179.71 136.53,180.97 56.52,180.97 53.34,177.8 19.68,177.8 18.41,176.53 SV5.TT | v17.78,180.97 16.51,180.97 16.51,191.13 17.78,192.41 SV10.TT
!EA_00_  (via drill 0.61)
  Top 0.254: v230.5,167 230.5,18.41 232.41,16.51 IC46.1 | v236.22,172.09 236.22,185.42 IC50.1
  Bottom 0.254: v230.5,167 235.59,172.09 v236.22,172.09 | IC50.2 238.12,186.06 236.85,186.06 IC50.1
!EA_01  (via drill 0.61)
  Top 0.254: v147.32,189.87 144.78,187.32 v144.78,180.97 | v13.97,180.97 12.7,179.71 12.7,177.16 SV5.NN
  Bottom 0.254: v147.32,189.87 239.4,189.87 243.21,193.68 IC50.5 | v144.78,180.97 144.15,181.61 55.88,181.61 52.7,178.44 15.24,178.44 13.34,176.53 SV5.NN | v13.97,180.97 13.97,191.13 12.7,192.41 SV10.NN
!EA_01_  (via drill 0.61)  (1 unrouted)
  Top 0.254: IC46.4 241.94,13.34 248.92,13.34 248.92,123.83 247.01,125.73 v247.01,167.64 | v242.57,172.09 240.03,174.62 240.03,190.5 238.76,191.77 IC50.7
  Bottom 0.254: v247.01,167.64 v242.57,172.09
!EA_02  (via drill 0.61)
  Top 0.254: v242.57,173.35 242.57,189.23 240.03,191.77 240.03,222.25 241.3,223.52 IC51.3 | v8.89,180.97 7.62,179.71 7.62,177.16 SV5.JJ
  Bottom 0.254: v242.57,173.35 131.44,173.35 129.54,175.26 9.53,175.26 8.26,176.53 SV5.JJ | v8.89,180.97 8.89,191.13 7.62,192.41 SV10.JJ
!EA_02_  (via drill 0.61)
  Top 0.254: v247.65,221.62 247.65,188.59 245.75,186.69 245.75,167.64 246.38,167 246.38,27.94 242.57,24.13 IC46.10
  Bottom 0.254: IC51.1 236.85,224.16 238.12,224.16 IC51.2 239.4,224.16 240.66,222.88 246.38,222.88 v247.65,221.62
!EF  (via drill 0.61)